# Altium schematic sheet Din Rail Patern.SchDoc
size Letter; DocumentNumber: 2; SheetNumber: 2; SheetTotal: 11; Pagesize: Letter
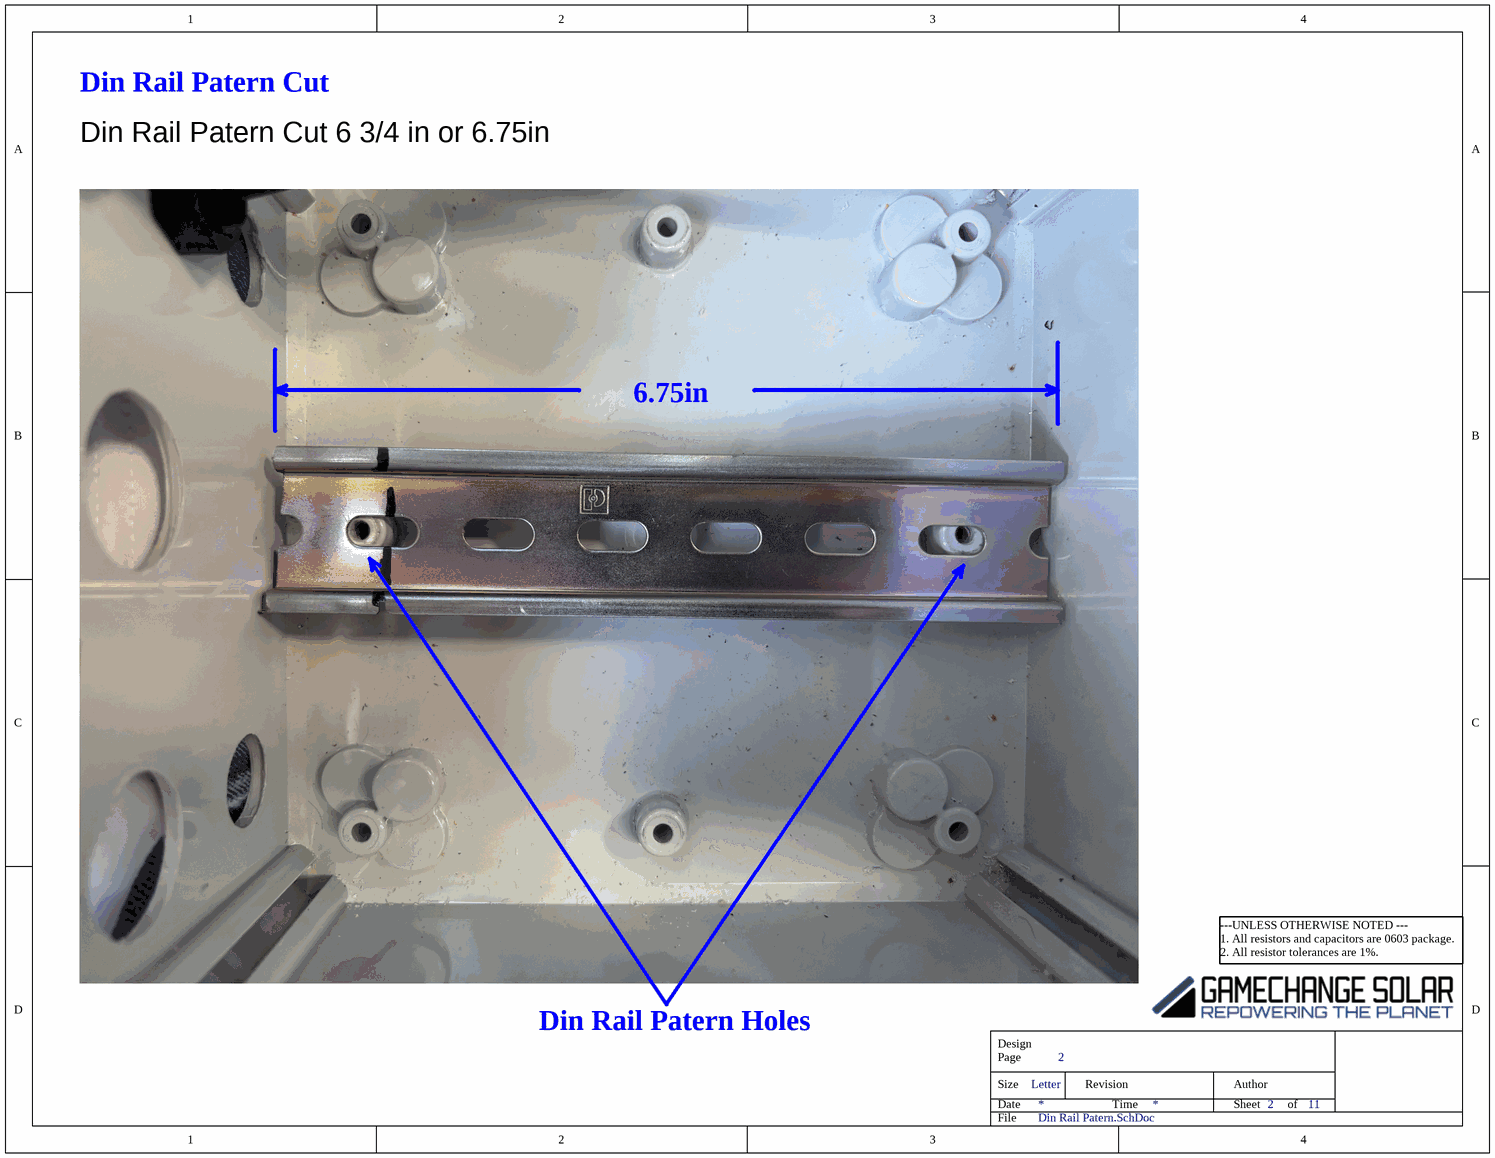
[diagram p0: Din Rail Patern.SchDoc]

## Notes on the sheet
- Din Rail Patern Cut
- Din Rail Patern Cut 6 3/4 in or 6.75in
- 6.75in
- Din Rail Patern Holes
- ---UNLESS OTHERWISE NOTED ---
  1. All resistors and capacitors are 0603 package.
  2. All resistor tolerances are 1%.
- Design
- Size
- Date
- Page
- Revision
- Time
- Sheet
- Author
- of
- File